# Altium schematic sheet Bluetooth.SchDoc
size A4
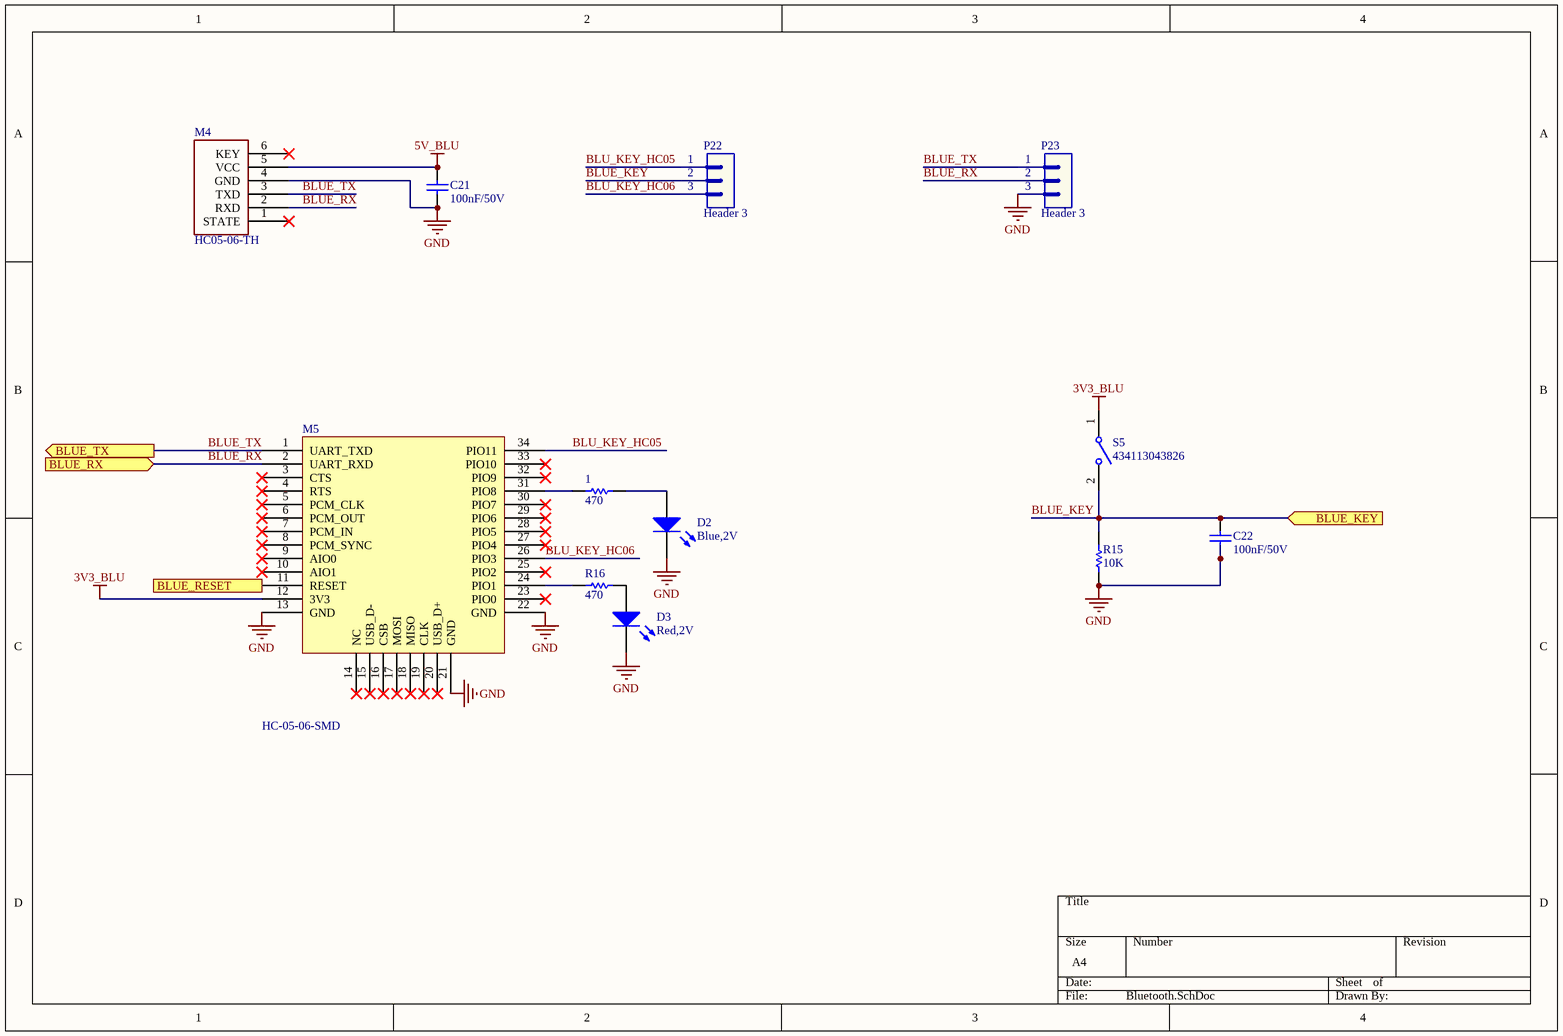
[diagram p0: Bluetooth.SchDoc]

## Parts
1  value 470  [RES-SM-0805]  (hidden comment: Res-1K-0805)
C21  value 100nF/50V  [CAP-SM-0805]  (hidden comment: Cap-1nF-50V-0805)
C22  value 100nF/50V  [CAP-SM-0805]  (hidden comment: Cap-1nF-50V-0805)
D2  value Blue,2V  [LED-3mm]  (hidden comment: LED-BLUE-TH-3mm)
D3  value Red,2V  [LED-3mm]  (hidden comment: LED-RED-TH-3mm)
M4  HC05-06-TH  [HC-05-06-TH]
M5  HC-05-06-SMD  [HC-05-06-SMD]
P22  Header 3  [JP3]
P23  Header 3  [JP3]
R15  value 10K  [RES-SM-0805]  (hidden comment: Res-0-0805)
R16  value 470  [RES-SM-0805]  (hidden comment: Res-1K-0805)
S5  434113043826  [434113043826]

## Ports
BLUE_KEY (in), BLUE_RESET (in), BLUE_RX (in), BLUE_TX (out)

## Nets
3V3_BLU: M5.12(3V3) S5.1
5V_BLU: C21.2 M4.5(VCC)
GND: C21.1 C22.1 D2.2(K) D3.2(K) M4.4(GND) M5.13(GND) M5.21(GND) M5.22(GND) P23.3 R15.2
BLU_KEY_HC05: M5.34(PIO11) P22.1
BLU_KEY_HC06: M5.26(PIO3) P22.3
BLUE_KEY: C22.2 P22.2 R15.1 S5.2 ; port BLUE_KEY
BLUE_RESET: M5.11(RESET) ; port BLUE_RESET
BLUE_RX: M4.2(RXD) M5.2(UART_RXD) P23.2 ; port BLUE_RX
BLUE_TX: M4.3(TXD) M5.1(UART_TXD) P23.1 ; port BLUE_TX
Net1_1: 1.1 M5.31(PIO8)
Net1_2: 1.2 D2.1(A)
NetD3_1: D3.1(A) R16.2
NetM5_24: M5.24(PIO1) R16.1

Not connected (* = marked no-connect by the designer): M4 1(STATE)* 6(KEY)*; M5 3(CTS)* 4(RTS)* 5(PCM_CLK)* 6(PCM_OUT)* 7(PCM_IN)* 8(PCM_SYNC)* 9(AIO0)* 10(AIO1)* 14(NC)* 15(USB_D-)* 16(CSB)* 17(MOSI)* 18(MISO)* 19(CLK)* 20(USB_D+)* 23(PIO0)* 25(PIO2)* 27(PIO4)* 28(PIO5)* 29(PIO6)* 30(PIO7)* 32(PIO9)* 33(PIO10)*

## Library data of the parts
1 R16 = Res-1K-0805: RES 1K OHM 1% 1/4W 0805; Manufacturer: Stackpole Electronics Inc; Manufacturer Part Number: RNCP0805FTD1K00; Local Supplier: thegioiic; Local Supplier Link: https://thegioiic.com/products/dien-tro-1k-ohm-0805-5; Supplier 1: Digikey; Supplier 1 Link: https://www.digikey.com/product-detail/en/stackpole-electronics-inc/RNCP0805FTD1K00/RNCP0805FTD1K00CT-ND/2240568; Supplier 1 Part Number: RNCP0805FTD1K00CT-ND
C21 C22 = Cap-1nF-50V-0805: CAP CER 1000PF 100V X7R 0805; Manufacturer: Johanson Dielectrics Inc.; Manufacturer Part Number: 101X15W102MV4E; Local Supplier: thegioiic; Local Supplier Link: https://thegioiic.com/products/tu-1nf-50v-0805; Supplier 1: Digikey; Supplier 1 Link: https://www.digikey.com/product-detail/en/johanson-dielectrics-inc/101X15W102MV4E/709-1335-1-ND/2327235; Supplier 1 Part Number: 709-1335-1-ND
D2 = LED-BLUE-TH-3mm: LED BLUE CLEAR T-1 T/H; Manufacturer: Kingbright; Manufacturer Part Number: WP710A10QBC/D; Local Supplier: thegioiic; Local Supplier Link: https://thegioiic.com/products/led-xanh-duong-3mm-chan-dai; Supplier 1: Digikey; Supplier 1 Link: https://www.digikey.com/product-detail/en/kingbright/WP710A10QBC-D/754-1596-ND/2769812; Supplier 1 Part Number: 754-1596-ND
D3 = LED-RED-TH-3mm: LED RED CLEAR T-1 T/H; Manufacturer: Kingbright; Manufacturer Part Number: WP710A10SEC/J3; Local Supplier: thegioiic; Local Supplier Link: https://thegioiic.com/products/led-do-3mm-chan-dai; Supplier 1: Digikey; Supplier 1 Link: https://www.digikey.com/product-detail/en/kingbright/WP710A10SEC-J3/754-1589-ND/2769815; Supplier 1 Part Number: 754-1589-ND
M5 = HC-05-06-SMD: Local supply: Hshop
P22 P23 = Header 3: Header, 3-Pin; LatestRevisionDate: 17-Jul-2002; LatestRevisionNote: Re-released for DXP Platform.; Publisher: Altium Limited
R15 = Res-0-0805: RES 0 OHM JUMPER 0805; Manufacturer: Vishay Dale; Manufacturer Part Number: WSL080500000ZEA9; Local Supplier: thegioiic; Local Supplier Link: https://thegioiic.com/products/dien-tro-0-ohm-0805-5; Supplier 1: Digikey; Supplier 1 Link: https://www.digikey.com/product-detail/en/vishay-dale/WSL080500000ZEA9/541-3928-1-ND/7423223; Supplier 1 Part Number: 541-3928-1-ND
S5 = 434113043826: WS-TASV J-Bend SMT Tact Switch 6x3.5mm, height 4.3mm, 260gf; Rated Voltage: 12VDC; Rated Current: 50mA; Washable: No; ComponentLink1Description: Manufacturer; ComponentLink1URL: http://www.we-online.de; ComponentLink2Description: Datasheet; ComponentLink2URL: https://katalog.we-online.com/em/datasheet/434113043826.pdf; Operating Temperature: -40 to +85degC; Part Number: 434113043826; Published Date: September 2019; Contact Material: Stainless Steel; Height: 4.3mm; Mounting Technology: SMT; Contact Plating: Silver; Operation Force: 260gf; Packaging: Tape and Reel; Terminal Material: Copper Alloy; Publisher: Wurth Elektronik; Terminal Plating: Silver